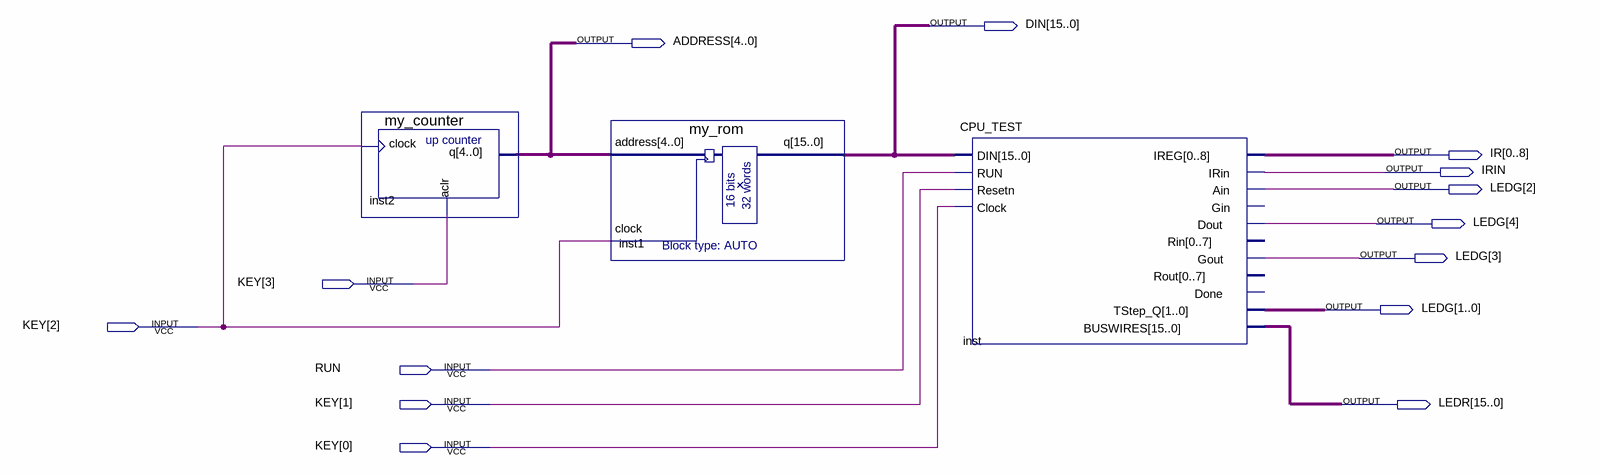
[diagram p0: schematic sheet]
// Quartus schematic CPU_WITH_MEMORY.bdf as structural Verilog: 3 symbols, 14 pins
module CPU_WITH_MEMORY (
  input  [3:0] KEY,
  input  RUN,
  output [15:0] DIN,
  output [4:0] ADDRESS,
  output [0:8] IR,
  output IRIN,
  output [4:0] LEDG,
  output [15:0] LEDR
);

  my_counter inst2 (.clock(KEY[2]), .aclr(KEY[3]), .q(ADDRESS));
  my_rom inst1 (.address(ADDRESS), .clock(KEY[2]), .q(DIN));
  CPU_TEST inst (
    .DIN(DIN), .RUN(RUN), .Resetn(KEY[1]), .Clock(KEY[0]), .IREG(IR), .IRin(IRIN), .Ain(LEDG[2]),
    .Dout(LEDG[4]), .Gout(LEDG[3]), .TStep_Q(LEDG[1:0]), .BUSWIRES(LEDR));  // open: Gin, Rin, Rout, Done
endmodule
